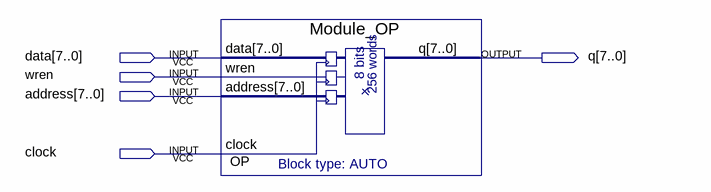
[diagram p0: schematic sheet]
// Quartus schematic OP_from_megawizard.bdf as structural Verilog: 1 symbols, 5 pins
module OP_from_megawizard (
  input  [7:0] data,
  input  wren,
  input  [7:0] address,
  input  clock,
  output [7:0] q
);

  Module_OP OP (.data(data), .wren(wren), .address(address), .clock(clock), .q(q));
endmodule
